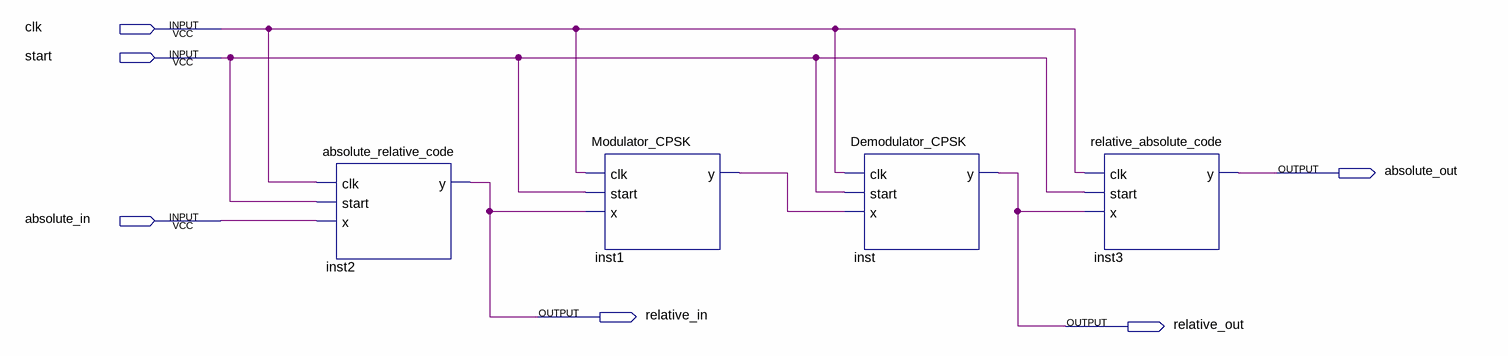
[diagram p0: schematic sheet]
// Quartus schematic DPSK_top.bdf as structural Verilog: 4 symbols, 6 pins
module DPSK_top (
  input  clk,
  input  start,
  input  absolute_in,
  output absolute_out,
  output relative_in,
  output relative_out
);

  wire inst1_y;

  absolute_relative_code inst2 (.clk(clk), .start(start), .x(absolute_in), .y(relative_in));
  Modulator_CPSK inst1 (.clk(clk), .start(start), .x(relative_in), .y(inst1_y));
  Demodulator_CPSK inst (.clk(clk), .start(start), .x(inst1_y), .y(relative_out));
  relative_absolute_code inst3 (.clk(clk), .start(start), .x(relative_out), .y(absolute_out));
endmodule
